# EAGLE design exp1.1.1 (EAGLE 9.6.2)
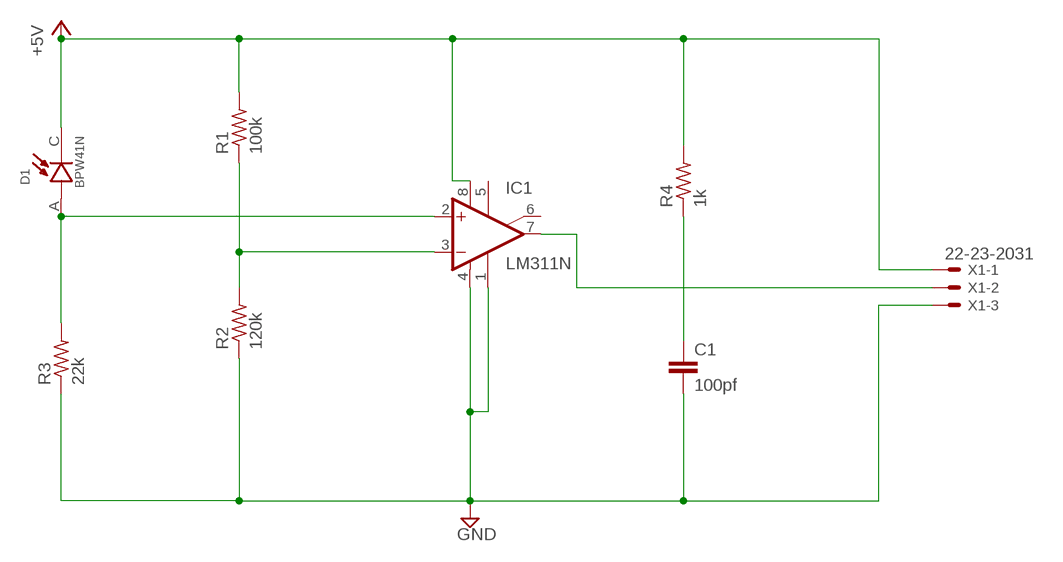
[diagram p0: schematic, sheet 1]

## Parts
C1  100pf  C2,5-3  [C2.5-3]
D1  BPW41N  [DIO_BPW41N]
IC1  LM311N  [DIL08]
R1  100k  R-US_0207/10  [0207/10]
R2  120k  R-US_0207/10  [0207/10]
R3  22k  R-US_0207/10  [0207/10]
R4  1k  R-US_0207/10  [0207/10]
X1  22-23-2031  [22-23-2031]

## Nets
+5V: D1.C IC1.8(V+) R1.2 R4.2 X1.1
GND: C1.2 IC1.1(GND) IC1.4(V-) R2.1 R3.1 X1.3
N$1: IC1.3(-IN) R1.1 R2.2
N$3: D1.A IC1.2(+IN) R3.2
N$4: C1.1 R4.1
N$5: IC1.7(OUT) X1.2
Unconnected: IC1.5(ON) IC1.6(ON/STR)

## Library data of the parts
C1 = capacitor-wima:C: CAPACITOR naming: grid - package width
D1 = BPW41N:BPW41N: BPW41N Series 65° Side View 950 nm PIN Photodiode Check availability <https://pricing.snapeda.com/parts/BPW41N/Vishay%20Semiconductor%20Opto%20Division/view-part?ref=eda>; AVAILABILITY: In Stock; DESCRIPTION: Photodiode 940nm 130° Radial, Side View; MF: Vishay Semiconductor Opto Division; MP: BPW41N; PACKAGE: None; PRICE: None; PURCHASE-URL: https://pricing.snapeda.com/search/part/BPW41N/?ref=eda
IC1 = linear:LM311: COMPARATOR
R1-R4 = rcl:R-US_: RESISTOR, American symbol; SPICEPREFIX: R
X1 = con-molex:22-23-2031: .100" (2.54mm) Center Header - 3 Pin; MF: MOLEX; MPN: 22-23-2031; OC_FARNELL: 1462950; OC_NEWARK: 30C0862

## Board
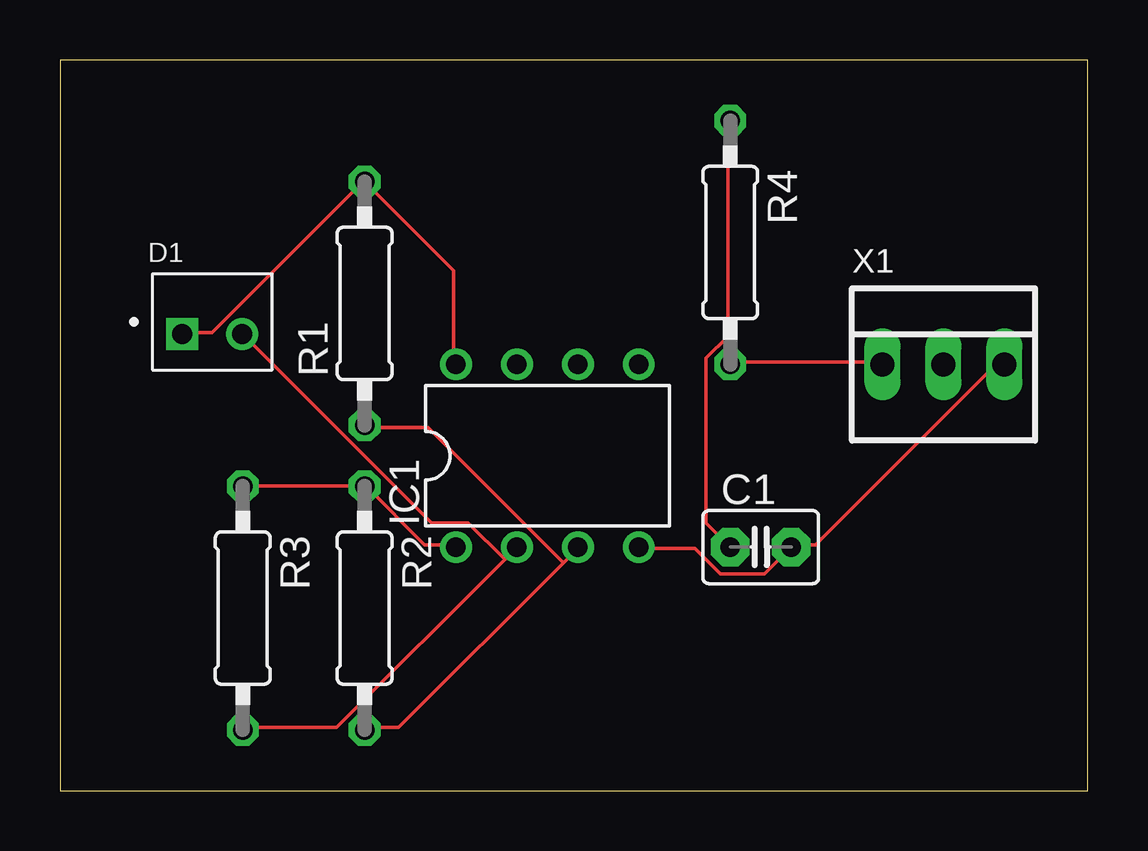
[diagram p1: board, top side]
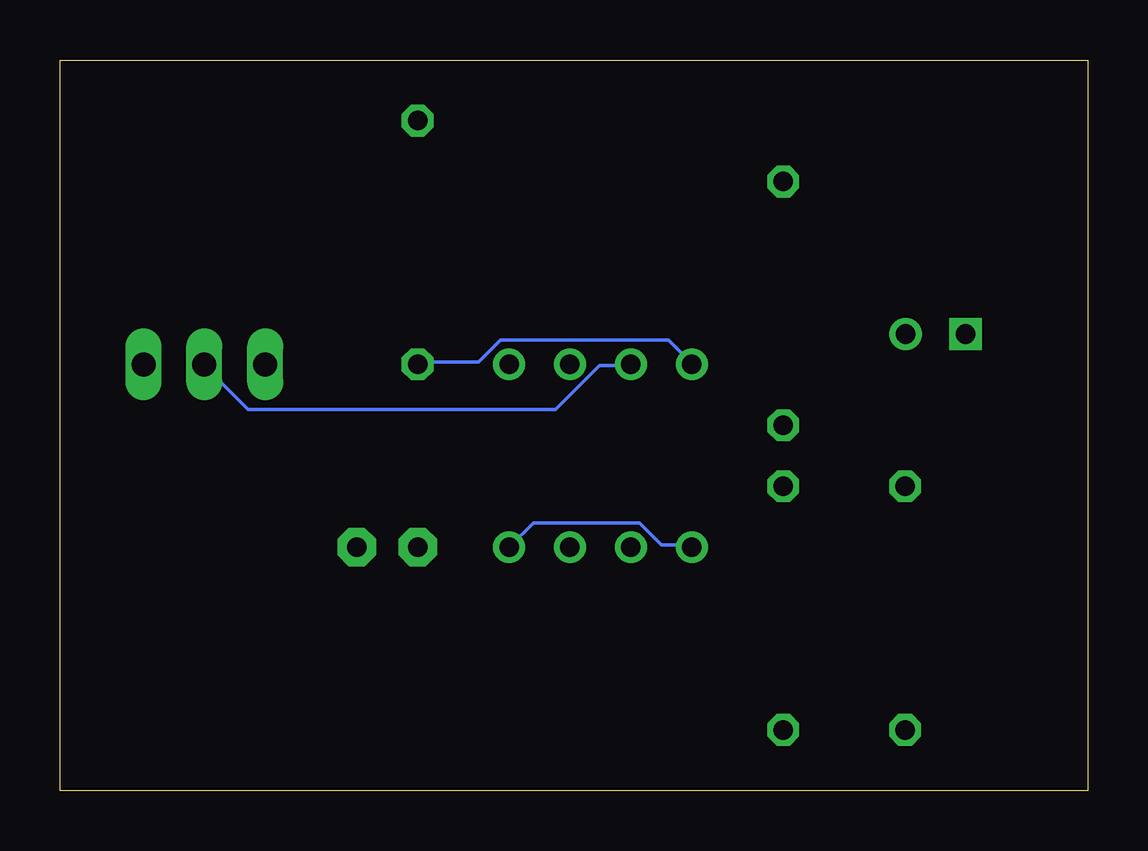
[diagram p2: board, bottom side, seen from below]

Size 42.85 x 30.47 mm. Coordinates in mm from the lower left corner, seen from the top.
Outline: 0,0 42.85,0 42.85,30.47 0,30.47 0,0
Copper layers (1*16): Top 0.035mm / dielectric 1.5mm / Bottom 0.035mm
Design rules "default": minimum track width 6mil, minimum drill 0.35mm, track to track 6mil, track to pad 6mil, pad to pad 6mil, via to via 6mil, smd to smd 6mil, copper to edge 40mil, drill to drill 6mil, minimum pad ring 10mil, minimum via ring 8mil, stop-mask expansion 4mil, vias tented up to drill 0mil, thermal gap 10mil

### Footprints (pad centres in the part's own frame; a part is rotated, then mirrored left to right if it is on the bottom)
C2.5-3 = drill 0.813 pad 1.6 octagon: 1 -1.27,0; 2 1.27,0
DIO_BPW41N = drill 0.83 pad 1.25: A 1.25,0 | drill 0.83 pad 1.25 square: C -1.25,0
DIL08 = drill 0.813 pad 1.27: 1 -3.81,-3.81; 2 -1.27,-3.81; 3 1.27,-3.81; 4 3.81,-3.81; 5 3.81,3.81; 6 1.27,3.81; 7 -1.27,3.81; 8 -3.81,3.81
0207/10 = drill 0.813 octagon: 1 -5.08,0; 2 5.08,0
22-23-2031 = drill 1 long: 1 -2.54,0; 2 0,0; 3 2.54,0

### Placement (x,y rotation side)
C1  29.21,10.16 0 top
D1  6.35,19.05 0 top
IC1  20.32,13.97 0 top
R1  12.7,20.32 90 top
R2  12.7,7.62 270 top
R3  7.62,7.62 270 top
R4  27.94,22.86 270 top
X1  36.83,17.78 0 top

### Tracks (layer width: path | path; a pad name or v marks a point on that pad's centre or on a via)
+5V
  Top 0.152: R4.2 27.99,17.88 34.24,17.88 X1.1 | IC1.8 16.41,17.88 16.41,21.69 R1.2 12.6,25.35 6.35,19.1 5.13,19.1 D1.C
  Bottom 0.152: R4.2 27.84,17.88 25.4,17.88 24.49,18.8 17.47,18.8 16.56,17.88 IC1.8
GND
  Top 0.152: IC1.1 16.41,10.26 15.19,10.26 12.75,12.7 R2.1 R3.1 | IC1.4 24.18,10.11 26.47,10.11 27.53,9.04 29.36,9.04 C1.2 30.58,10.26 31.5,10.26 38.96,17.73 39.27,17.73 X1.3
  Bottom 0.152: IC1.4 23.11,11.18 18.69,11.18 17.78,10.26 16.56,10.26 IC1.1
N$1
  Top 0.152: 20.98,9.5 21.59,10.11 IC1.3 | 20.98,9.5 14.12,2.64 12.75,2.64 R2.2 | 20.98,9.5 15.34,15.14 12.75,15.14 R1.1
N$3
  Top 0.152: IC1.2 18.54,9.65 | 18.54,9.65 11.53,2.64 7.72,2.64 R3.2 | 18.54,9.65 17.02,11.18 15.49,11.18 7.72,18.95 D1.A
N$4
  Top 0.152: C1.1 26.92,11.18 26.92,18.03 27.84,18.95 27.84,27.94 R4.1
N$5
  Bottom 0.152: IC1.7 19.15,17.73 20.37,17.73 22.2,15.9 35,15.9 36.83,17.73 X1.2